# EAGLE design Micro__BLDC (EAGLE 6.5.0)
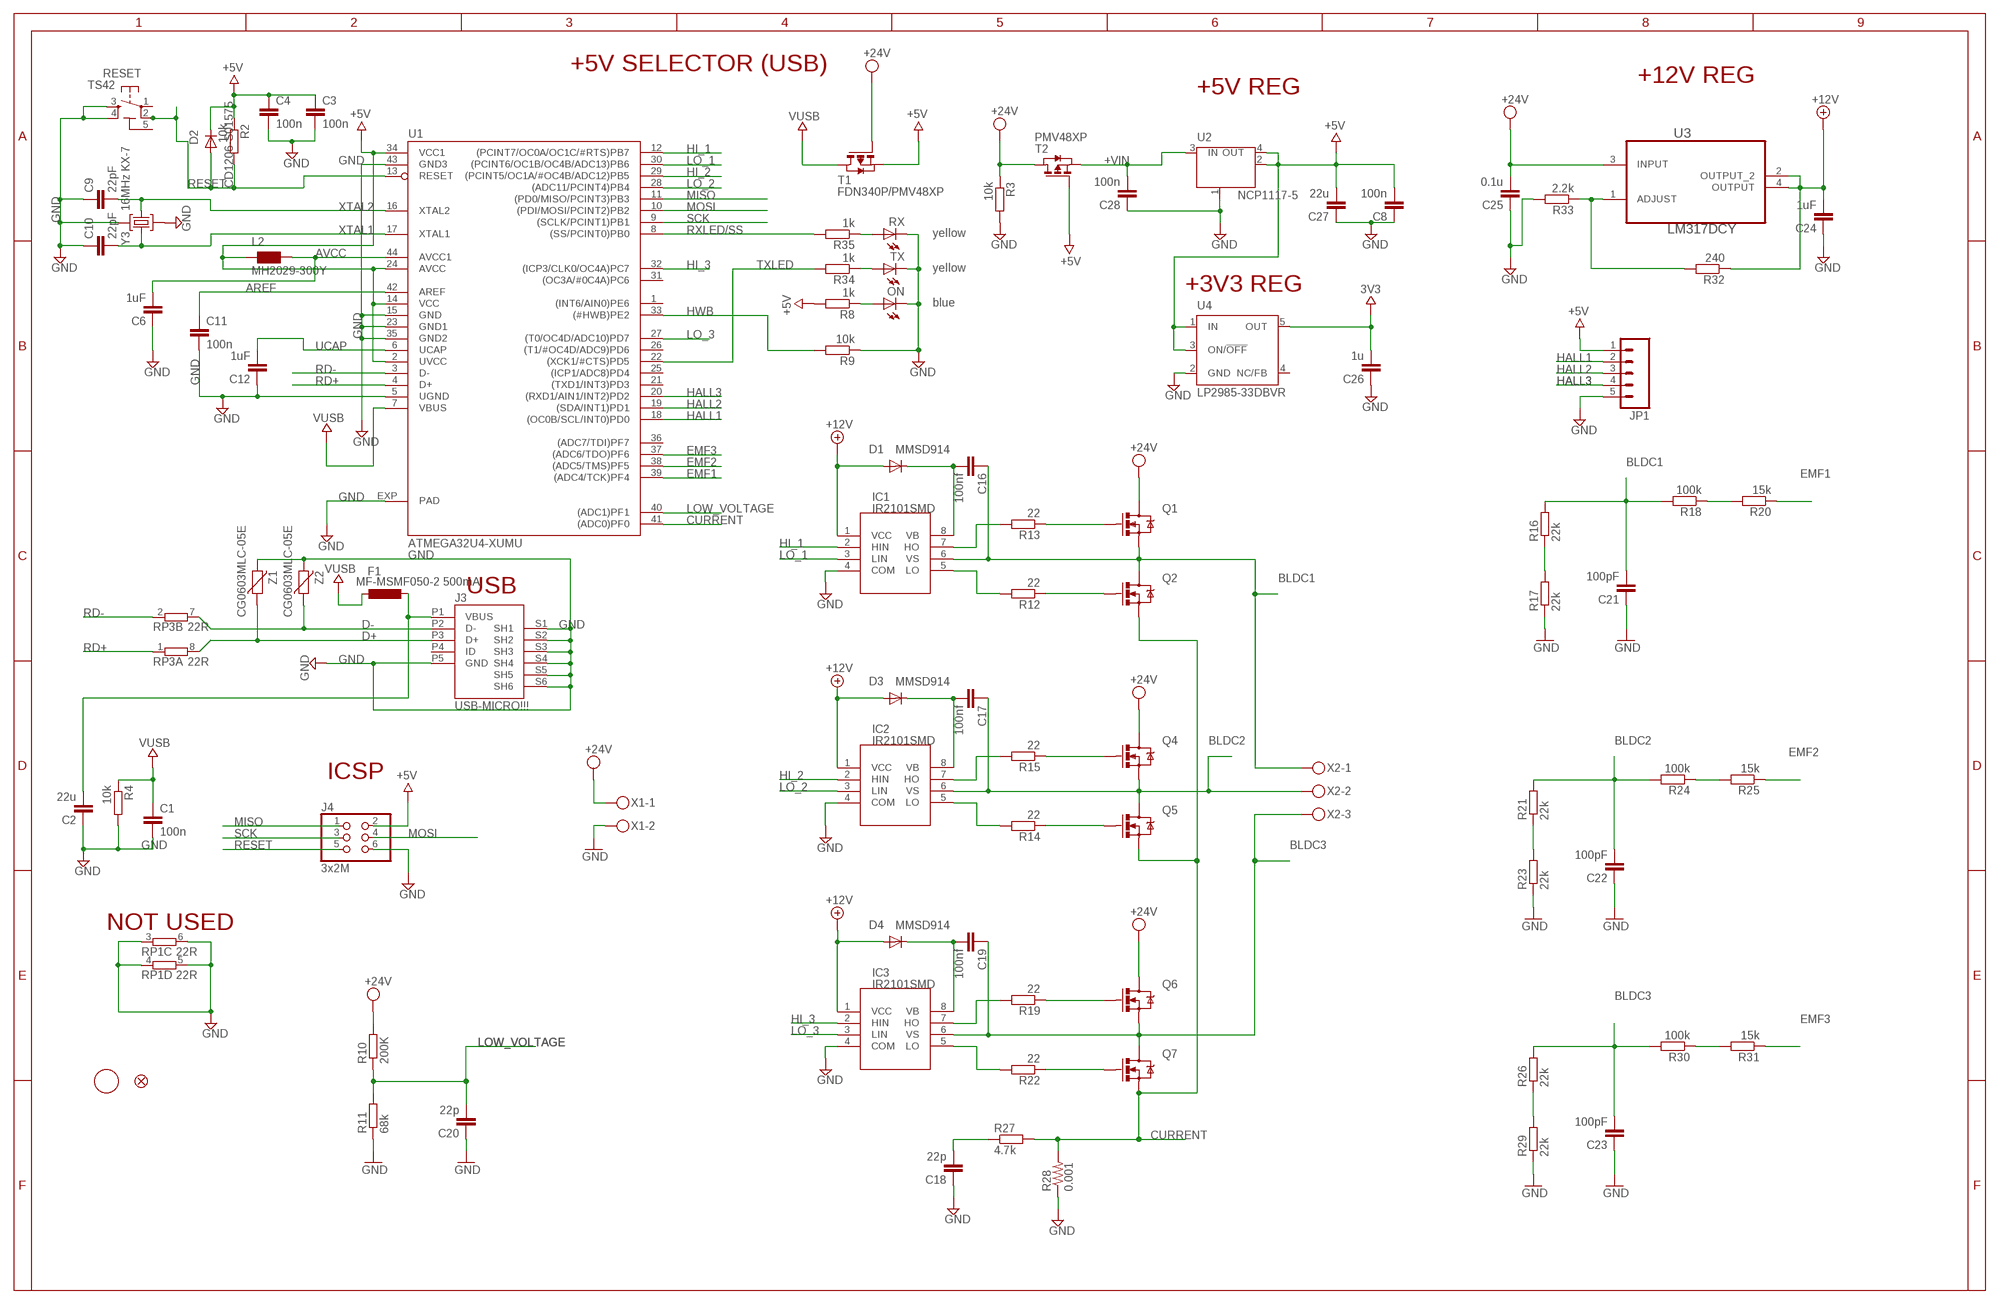
[diagram p0: schematic, sheet 1]

## Parts
C1  100n  C-EUC1206  [C1206]
C2  22u  C-EUC1206  [C1206]
C3  100n  C-EUC1206  [C1206]
C4  100n  C-EUC1206  [C1206]
C6  1uF  C-EUC1206  [C1206]
C8  100n  C-EUC1206  [C1206]
C9  22pF  C-EUC1206  [C1206]
C10  22pF  C-EUC1206  [C1206]
C11  100n  C-EUC1206  [C1206]
C12  1uF  C-EUC1206  [C1206]
C16  100nf  C-EUC1206  [C1206]
C17  100nf  C-EUC1206  [C1206]
C18  22p  C-EUC1206  [C1206]
C19  100nf  C-EUC1206  [C1206]
C20  22p  C-EUC1206  [C1206]
C21  100pF  C-EUC1206  [C1206]
C22  100pF  C-EUC1206  [C1206]
C23  100pF  C-EUC1206  [C1206]
C24  1uF  C-EUC1206  [C1206]
C25  0.1u  C-EUC1206  [C1206]
C26  1u  C-EUC1206  [C1206]
C27  22u  C-EUC1206  [C1206]
C28  100n  C-EUC1206  [C1206]
D1  MMSD914  DIODE-SOD123  [SOD123]
D2  CD1206-S01575  DIODE-MINIMELF  [MINIMELF]
D3  MMSD914  DIODE-SOD123  [SOD123]
D4  MMSD914  DIODE-SOD123  [SOD123]
F1  MF-MSMF050-2 500mA  L-EUL1812  [L1812]
IC1  IR2101SMD  [SO08]
IC2  IR2101SMD  [SO08]
IC3  IR2101SMD  [SO08]
J3  USB-MICRO!!!  MYCON2_USB-MINI-B  [CON2_USB_MICRO_B_AT]
J4  3x2M  PINHD-2X3  [2X03]
JP1  M05PTH  [1X05]
L2  MH2029-300Y  WE-CBF_0805  [0805]
ON  blue  LEDCHIPLED_0805  [CHIPLED_0805]
Q1  MOSFET-NCHANNELPTH2  [TO220V]
Q2  MOSFET-NCHANNELPTH2  [TO220V]
Q4  MOSFET-NCHANNELPTH2  [TO220V]
Q5  MOSFET-NCHANNELPTH2  [TO220V]
Q6  MOSFET-NCHANNELPTH2  [TO220V]
Q7  MOSFET-NCHANNELPTH2  [TO220V]
R2  10k  R-EU_R1206  [R1206]
R3  10k  R-EU_R1206  [R1206]
R4  10k  R-EU_R1206  [R1206]
R8  1k  R-EU_R1206  [R1206]
R9  10k  R-EU_R1206  [R1206]
R10  200K  R-EU_R1206  [R1206]
R11  68k  R-EU_R1206  [R1206]
R12  22  R-EU_R1206  [R1206]
R13  22  R-EU_R1206  [R1206]
R14  22  R-EU_R1206  [R1206]
R15  22  R-EU_R1206  [R1206]
R16  22k  R-EU_R1206  [R1206]
R17  22k  R-EU_R1206  [R1206]
R18  100k  R-EU_R1206  [R1206]
R19  22  R-EU_R1206  [R1206]
R20  15k  R-EU_R1206  [R1206]
R21  22k  R-EU_R1206  [R1206]
R22  22  R-EU_R1206  [R1206]
R23  22k  R-EU_R1206  [R1206]
R24  100k  R-EU_R1206  [R1206]
R25  15k  R-EU_R1206  [R1206]
R26  22k  R-EU_R1206  [R1206]
R27  4.7k  R-EU_R1206  [R1206]
R28  0.001  R-US_R2512  [R2512]
R29  22k  R-EU_R1206  [R1206]
R30  100k  R-EU_R1206  [R1206]
R31  15k  R-EU_R1206  [R1206]
R32  240  R-EU_R1206  [R1206]
R33  2.2k  R-EU_R1206  [R1206]
R34  1k  R-EU_R1206  [R1206]
R35  1k  R-EU_R1206  [R1206]
RESET  TS42  [TS42]
RP1  22R  4R-NCAY16  [CAY16]
RP3  22R  4R-NCAY16  [CAY16]
RX  yellow  LEDCHIPLED_0805  [CHIPLED_0805]
T1  FDN340P/PMV48XP  PMOSSOT23  [SOT-23]
T2  PMV48XP  PMOSSOT23  [SOT-23]
TX  yellow  LEDCHIPLED_0805  [CHIPLED_0805]
U1  ATMEGA32U4-XUMU  [QFN44ML7X7]
U2  NCP1117-5  LINEAR_MC33269ST  [LINEAR_SOT223]
U3  LM317DCY  [SOT230P700X180-4N]
U4  LP2985-33DBVR  LP2985-XXDBVR33  [SOT23-DBV]
U$37  FIDUCIALMOUNT  [FIDUCIA-MOUNT]
U$53  FIDUCIAL1X2  [FIDUCIAL-1X2]
X1  MKDSN1,5/2-5,08  [MKDSN1,5/2-5,08]
X2  MKDSN1,5/3-5,08  [MKDSN1,5/3-5,08]
Y3  16MHz KX-7  CRYSTAL-3.2-2.5  [CRYSTAL-3.2-2.5]
Z1  CG0603MLC-05E  VARISTORCN0603  [CT/CN0603]
Z2  CG0603MLC-05E  VARISTORCN0603  [CT/CN0603]

## Nets
3V3: C26.2 U4.5(OUT)
+5V: C3.1 C4.1 C8.2 C27.2 D2.C J4.2 JP1.1 L2.1 R2.1 R8.2 T1.2(S) T2.3(G) U1.2(UVCC) U1.14(VCC) U1.24(AVCC) U1.34(VCC1) U2.2(OUT) U2.4(OUT) U4.1(IN) U4.3(ON/!OFF)
+12V: C24.2 D1.A D3.A D4.A IC1.1(VCC) IC2.1(VCC) IC3.1(VCC) R32.1 U3.2(OUTPUT_2) U3.4(OUTPUT)
+VIN: C28.2 T2.2(S) U2.3(IN)
AREF: C11.1 U1.42(AREF)
AVCC: C6.2 L2.2 U1.44(AVCC1)
BLDC1: C16.1 C21.2 IC1.6(VS) Q1.3(S) Q2.2(D) R16.2 R18.2 X2.1
BLDC2: C17.1 C22.2 IC2.6(VS) Q4.3(S) Q5.2(D) R21.2 R24.2 X2.2
BLDC3: C19.1 C23.2 IC3.6(VS) Q6.3(S) Q7.2(D) R26.2 R30.2 X2.3
CURRENT: Q2.3(S) Q5.3(S) Q7.3(S) R27.2 R28.2 U1.41((ADC0)PF0)
D+: J3.P3(D+) RP3.8 Z1.1
D-: J3.P2(D-) RP3.7 Z2.1
EMF1: R20.1 U1.39((ADC4/TCK)PF4)
EMF2: R25.1 U1.38((ADC5/TMS)PF5)
EMF3: R31.1 U1.37((ADC6/TDO)PF6)
GND: C1.2 C2.1 C3.2 C4.2 C6.1 C8.1 C9.1 C10.1 C11.2 C12.1 C18.1 C20.1 C21.1 C22.1 C23.1 C24.1 C25.1 C26.1 C27.1 C28.1 IC1.4(COM) IC2.4(COM) IC3.4(COM) J3.P5(GND) J3.S1(SH1) J3.S2(SH2) J3.S3(SH3) J3.S4(SH4) J3.S5(SH5) J3.S6(SH6) J4.6 JP1.5 ON.C R3.2 R4.2 R9.1 R11.1 R17.1 R23.1 R28.1 R29.1 R33.2 RESET.3 RESET.4 RP1.3 RP1.4 RP1.5 RP1.6 RX.C TX.C U1.5(UGND) U1.15(GND) U1.23(GND1) U1.35(GND2) U1.43(GND3) U1.EXP(PAD) U2.1(GND/ADJ) U4.2(GND) X1.2 Y3.2(GND) Y3.4(GND) Z1.2 Z2.2
HALL1: JP1.2 U1.18((OC0B/SCL/INT0)PD0)
HALL2: JP1.3 U1.19((SDA/INT1)PD1)
HALL3: JP1.4 U1.20((RXD1/AIN1/INT2)PD2)
HI_1: IC1.2(HIN) U1.12((PCINT7/OC0A/OC1C/#RTS)PB7)
HI_2: IC2.2(HIN) U1.29((PCINT5/OC1A/#OC4B/ADC12)PB5)
HI_3: IC3.2(HIN) U1.32((ICP3/CLK0/OC4A)PC7)
HWB: R9.2 U1.33((#HWB)PE2)
LO_1: IC1.3(LIN) U1.30((PCINT6/OC1B/OC4B/ADC13)PB6)
LO_2: IC2.3(LIN) U1.28((ADC11/PCINT4)PB4)
LO_3: IC3.3(LIN) U1.27((T0/OC4D/ADC10)PD7)
LOW_VOLTAGE: C20.2 R10.1 R11.2 U1.40((ADC1)PF1)
MISO: J4.1 U1.11((PD0/MISO/PCINT3)PB3)
MOSI: J4.4 U1.10((PDI/MOSI/PCINT2)PB2)
N$1: Q4.1(G) R15.1
N$2: R35.1 RX.A
N$3: ON.A R8.1
N$4: R34.1 TX.A
N$5: R32.2 R33.1 U3.1(ADJUST)
N$9: C18.2 R27.1
N$11: R16.1 R17.2
N$12: R18.1 R20.2
N$13: IC3.7(HO) R19.2
N$14: Q6.1(G) R19.1
N$15: Q7.1(G) R22.1
N$16: IC3.5(LO) R22.2
N$17 [usbvcc]: C19.2 D4.C IC3.8(VB)
N$18: R21.1 R23.2
N$19: R24.1 R25.2
N$21: IC2.7(HO) R15.2
N$23 [gnd]: Q5.1(G) R14.1
N$24: IC2.5(LO) R14.2
N$25 [usbvcc]: C17.2 D3.C IC2.8(VB)
N$26: R26.1 R29.2
N$28: R30.1 R31.2
N$29: IC1.7(HO) R13.2
N$30: Q1.1(G) R13.1
N$31: Q2.1(G) R12.1
N$32: IC1.5(LO) R12.2
N$33 [usbvcc]: C16.2 D1.C IC1.8(VB)
RD+: RP3.1 U1.4(D+)
RD-: RP3.2 U1.3(D-)
RESET: D2.A J4.5 R2.2 RESET.2 U1.13(RESET)
RXLED/SS: R35.2 U1.8((SS/PCINT0)PB0)
SCK: J4.3 U1.9((SCLK/PCINT1)PB1)
TXLED: R34.2 U1.22((XCK1/#CTS)PD5)
UCAP: C12.2 U1.6(UCAP)
VCC: C25.2 Q1.2(D) Q4.2(D) Q6.2(D) R3.1 R10.2 T1.3(G) T2.1(D) U3.3(INPUT) X1.1 ; supply symbol labelled +24V
VUSB: C1.1 F1.2 R4.1 T1.1(D) U1.7(VBUS)
VUSBD: C2.2 F1.1 J3.P1(VBUS)
XTAL1: C10.2 U1.17(XTAL1) Y3.3(C2)
XTAL2: C9.2 U1.16(XTAL2) Y3.1(C1)
Unconnected: J3.P4(ID) RESET.1 RP1.1 RP1.2 RP1.7 RP1.8 RP3.3 RP3.4 RP3.5 RP3.6 U1.1((INT6/AIN0)PE6) U1.21((TXD1/INT3)PD3) U1.25((ICP1/ADC8)PD4) U1.26((T1/#OC4D/ADC9)PD6) U1.31((OC3A/#0C4A)PC6) U1.36((ADC7/TDI)PF7) U4.4(NC/FB)

## Notes on the sheet
- +5V SELECTOR (USB)
- +12V REG
- +5V REG
- +3V3 REG
- USB
- ICSP
- NOT USED

## Power pins joined to a net without a drawn wire
5-GND: RESET.5(5-GND)

## Library data of the parts
C1-C4 C6 C8-C12 C16-C28 = SmartPrj:C-EU: CAPACITOR, European symbol
D1-D4 = diode:DIODE-: DIODE
F1 = rcl:L-EU: INDUCTOR, European symbol
IC1-IC3 = IR:IR2101
J3 = SmartPrj:MYCON2_USB-MINI-B
J4 = SmartPrj:PINHD-2X3: PIN HEADER
JP1 = SparkFun-Connectors:M05: Header 5 Standard 5-pin 0.1" header. Use with straight break away headers (SKU : PRT-00116), right angle break away headers (PRT-00553), swiss pins (PRT-00743), machine pins (PRT-00117), and female headers (PRT-00115). Molex polarized connector foot print use with SKU : PRT-08230 with associated crimp pins and housings.
L2 = wuerth-elektronik:WE-CBF: SMD EMI Suppression Ferrite Beads - excellent anti-EMI properties - low DCR - impedances till 3000 ohms - rated current up to 6 A
ON RX TX = led:LED: LED OSRAM: - CHIPLED LG R971, LG N971, LY N971, LG Q971, LY Q971, LO R971, LY R971 LH N974, LH R974 LS Q976, LO Q976, LY Q976 LO Q996 - Hyper CHIPLED LW Q18S LB Q993, LB Q99A, LB R99A - SideLED LS A670, LO A670, LY A670, LG A670, LP A670 LB A673, LV A673, LT A673, LW A673 LH A674 LY A675 LS A676, LA A676, LO A676, LY A676, LW A676 LS A679, LY A679, LG A679 - Hyper Micro SIDELED® LS Y876, LA Y876, LO Y876, LY Y876 LT Y87S - SmartLED LW L88C, LW L88S LB L89C, LB L89S, LG L890 LS L89K, LO L89K, LY L89K LS L896, LA L896, LO L896, LY L896 - TOPLED LS T670, LO T670, LY T670, LG T670, LP T670 LSG T670, LSP T670, LSY T670, LOP T670, LYG T670 LG T671, LOG T671, LSG T671 LB T673, LV T673, LT T673, LW T673 LH T674 LS T676, LA T676, LO T676, LY T676, LB T676, LH T676, LSB T676, LW T676 LB T67C, LV T67C, LT T67C, LS T67K, LO T67K, LY T67K, LW E67C LS E67B, LA E67B, LO E67B, LY E67B, LB E67C, LV E67C, LT E67C LW T67C LS T679, LY T679, LG T679 LS T770, LO T770, LY T770, LG T770, LP T770 LB T773, LV T773, LT T773, LW T773 LH T774 LS E675, LA E675, LY E675, LS T675 LS T776, LA T776, LO T776, LY T776, LB T776 LHGB T686 LT T68C, LB T68C - Hyper Mini TOPLED® LB M676 - Mini TOPLED Santana® LG M470 LS M47K, LO M47K, LY M47K Source: http://www.osram.convergy.de LUXEON: - LUMILED® LXK2-PW12-R00, LXK2-PW12-S00, LXK2-PW14-U00, LXK2-PW14-V00 LXK2-PM12-R00, LXK2-PM12-S00, LXK2-PM14-U00 LXK2-PE12-Q00, LXK2-PE12-R00, LXK2-PE12-S00, LXK2-PE14-T00, LXK2-PE14-U00 LXK2-PB12-K00, LXK2-PB12-L00, LXK2-PB12-M00, LXK2-PB14-N00, LXK2-PB14-P00, LXK2-PB14-Q00 LXK2-PR12-L00, LXK2-PR12-M00, LXK2-PR14-Q00, LXK2-PR14-R00 LXK2-PD12-Q00, LXK2-PD12-R00, LXK2-PD12-S00 LXK2-PH12-R00, LXK2-PH12-S00 LXK2-PL12-P00, LXK2-PL12-Q00, LXK2-PL12-R00 Source: www.luxeon.com KINGBRIGHT: KA-3528ASYC Source: www.kingbright.com
Q1 Q2 Q4-Q7 = SparkFun:MOSFET-NCHANNEL
R2-R4 R8-R27 R29-R35 = SmartPrj:R-EU_: RESISTOR, European symbol
R28 = resistor:R-US_: RESISTOR, American symbol
RESET = SmartPrj:TS42: TS42 Dongnan Electronics Tact switch VDC 12V - 50mA
RP1 RP3 = resistor-dil:4R-N: Array Chip Resistor Source: RS Component / Phycomp
T1 T2 = zetex:PMOSSOT23: MOS FET
U1 = SmartPrj:ATMEGA32U4-XU
U2 = SmartPrj:LINEAR_MC33269ST*: Adjustable Output Low Dropout Voltage Regulator 800 mA Source: http://www.onsemi.com/pub/Collateral/MC33269-D.PDF
U3 = Texas Instruments_By_element14_Batch_1:LM317DCY: IC ADJ LINEAR REG 1.25V TO 37V; MPN: LM317DCY; OC_FARNELL: 1626539; OC_NEWARK: 75C0809; PACKAGE: SOT-223-3; SUPPLIER: TEXAS INSTRUMENTS
U4 = SmartPrj:LP2985-XXDBVR: ULTRALOW-POWER 50-mA LOW-DROPOUT LINEAR REGULATORS 50-mA Low-Dropout Regulator Source: http://focus.ti.com/lit/ds/symlink/tps77001.pdf
U$37 = SmartPrj:FIDUCIALMOUNT
U$53 = SparkFun:FIDUCIAL: Fiducial Alignment Points Various fiducial points for machine vision alignment.
X1 = con-phoenix-508:MKDSN1,5/2-5,08: MKDSN 1,5/ 2-5,08 Printklemme Nennstrom: 13,5 A Nennspannung: 250 V Rastermaß: 5,08 mm Polzahl: 2 Anschlussart: Schraubanschluss Montage: Löten Anschlussrichtung Leiter/Platine: 0 ° Artikelnummer: 1729128 Source: http://eshop.phoenixcontact.com .. 1729128.pdf; MPN: MKDSN 1,5/2-5.08; OC_FARNELL: 1792903; OC_NEWARK: 30M2397
X2 = con-phoenix-508:MKDSN1,5/3-5,08: MKDSN 1,5/ 3-5,08 Printklemme Nennstrom: 13,5 A Nennspannung: 250 V Rastermaß: 5,08 mm Polzahl: 3 Anschlussart: Schraubanschluss Montage: Löten Anschlussrichtung Leiter/Platine: 0 ° Artikelnummer: 1729131 Source: http://eshop.phoenixcontact.com .. 1729131.pdf; MPN: SMKDSN1,5/3-5,08; OC_FARNELL: 1792904; OC_NEWARK: 70R0299
Y3 = SmartPrj:CRYSTAL-3.2-2.5
Z1 Z2 = varistor:VARISTOR: VARISTOR

## Net classes
0 default: width 0.254 mm, drill 0.61 mm, clearance 0.203 mm
2 gnd: width 0.254 mm, drill 0.61 mm, clearance 0.254 mm
3 usbvcc: width 0.254 mm, drill 0.61 mm, clearance 0.254 mm

## Board
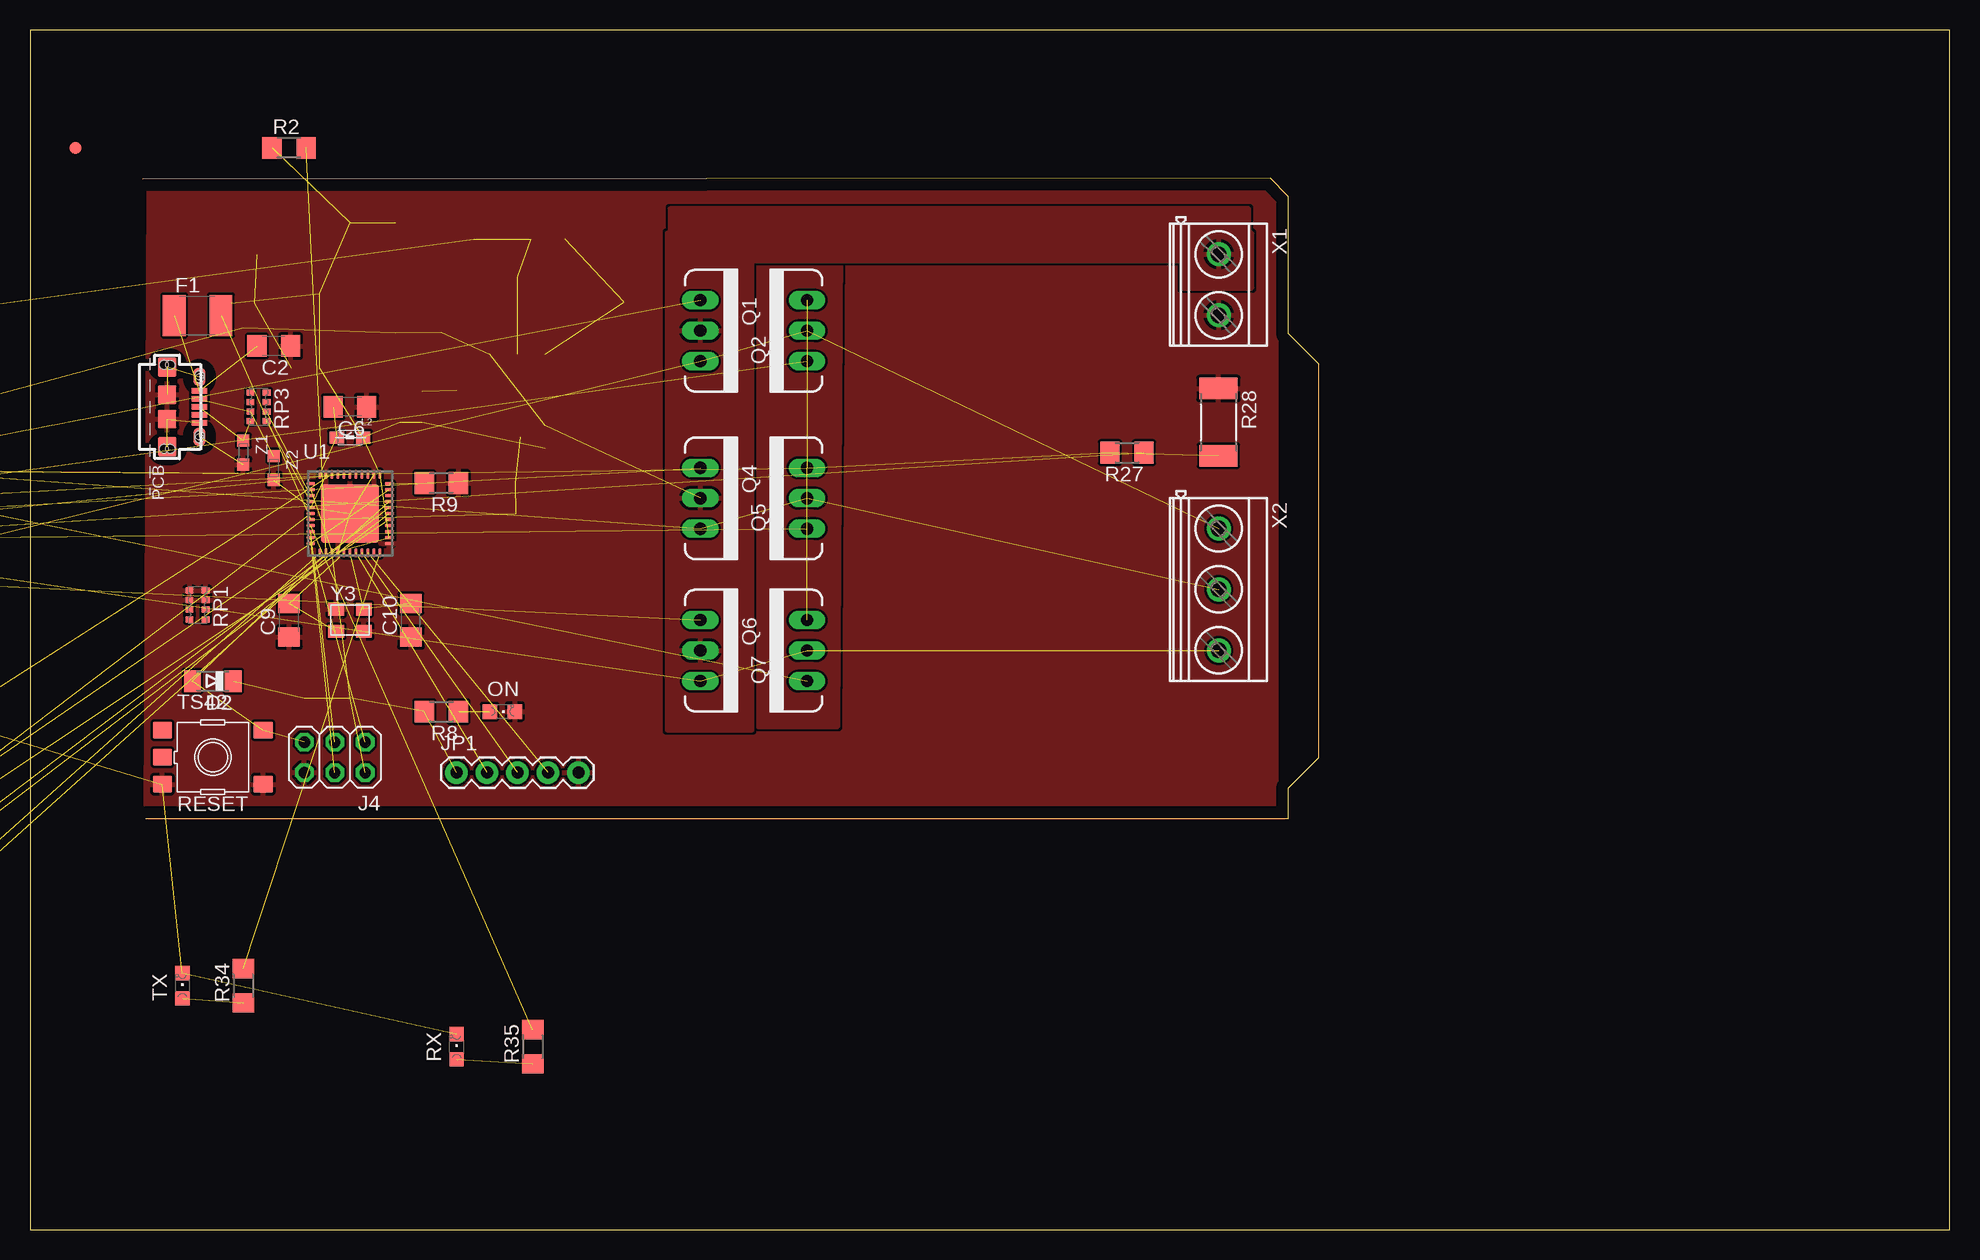
[diagram p1: board, top side]
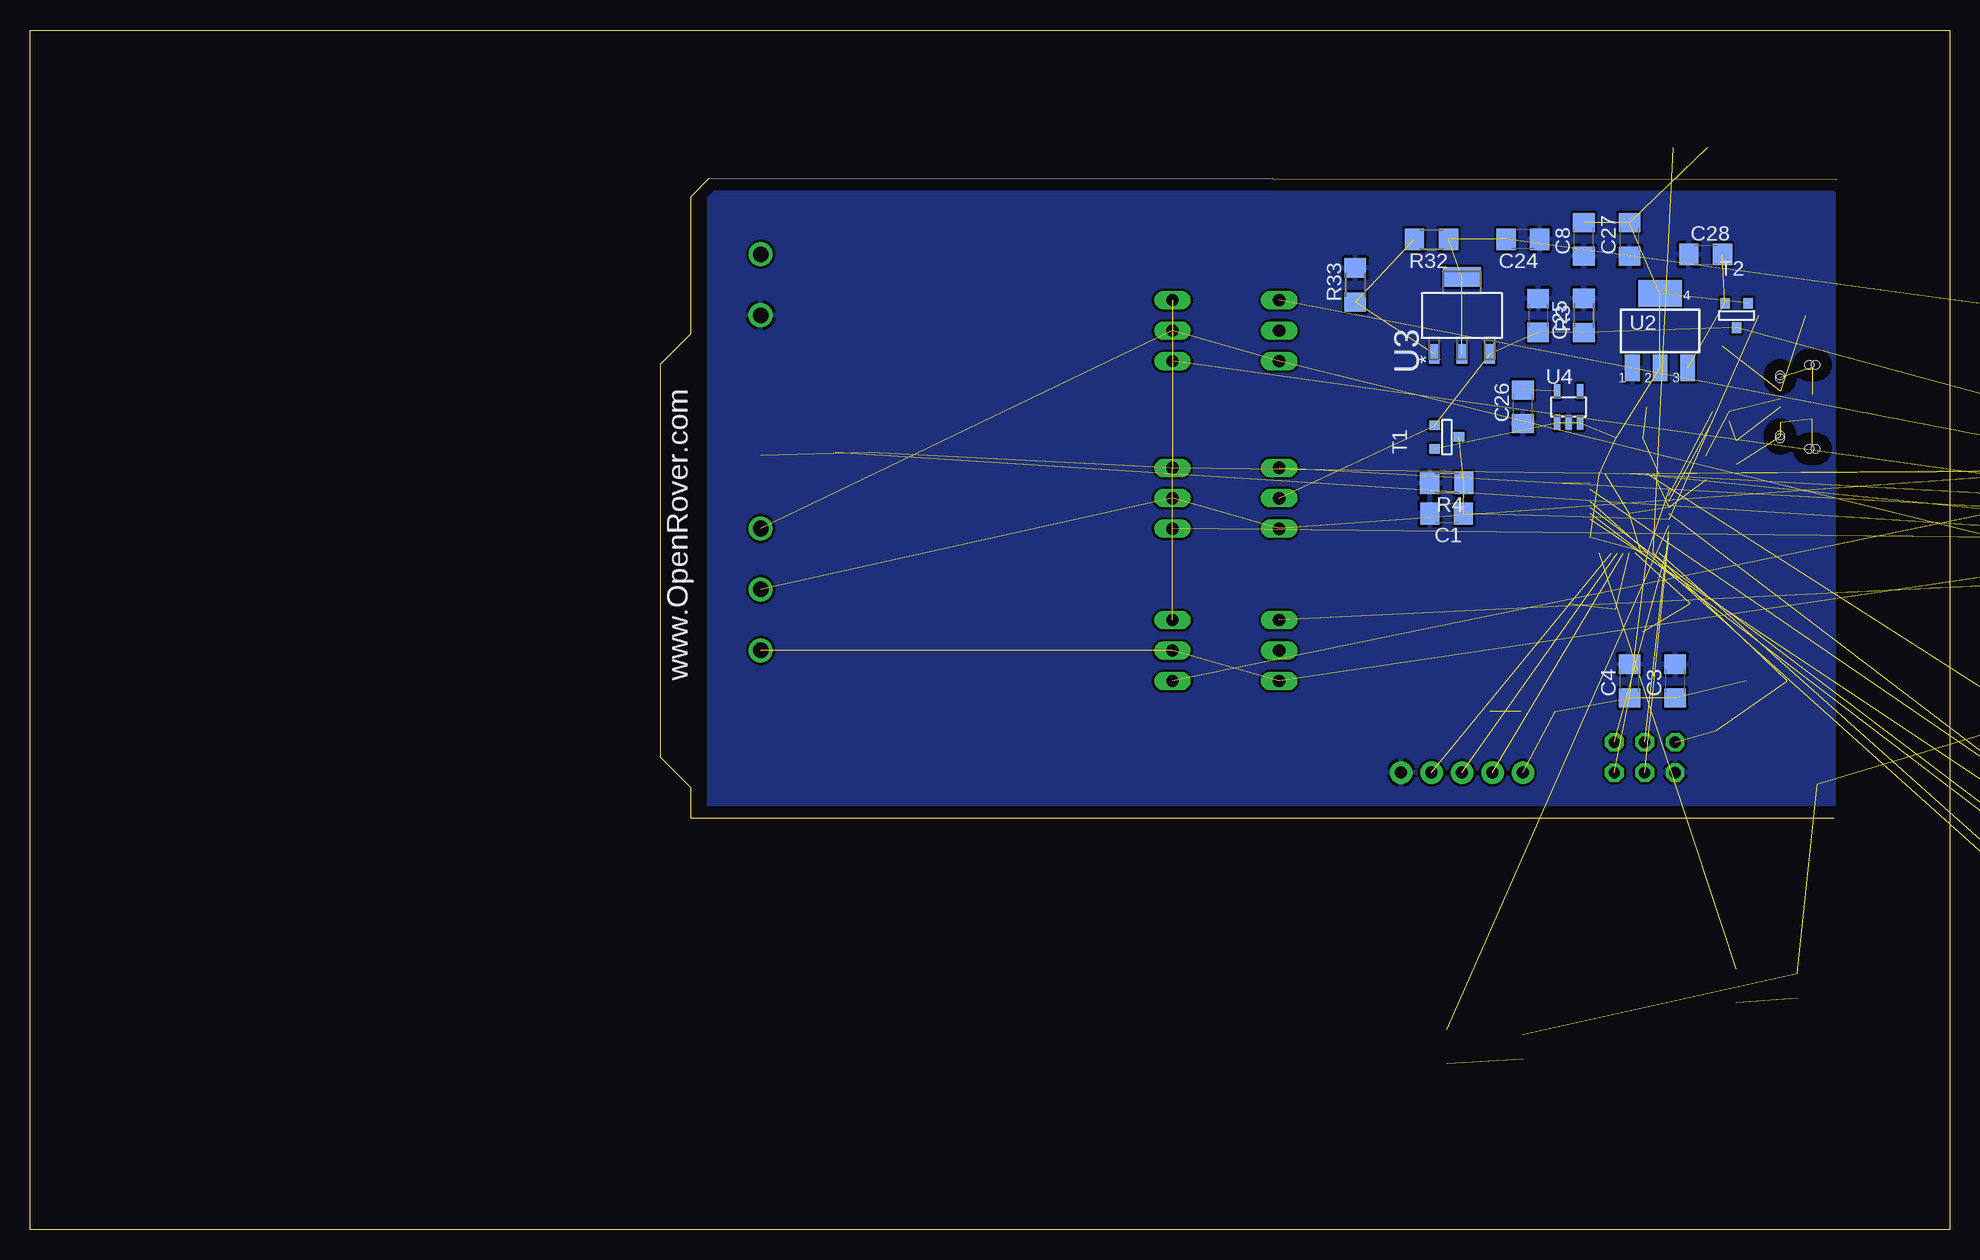
[diagram p2: board, bottom side, seen from below]

Size 160 x 100 mm. Coordinates in mm from the lower left corner, seen from the top.
Outline: 9.65,34.29 104.9,34.29 104.9,36.83 107.44,39.37 107.44,72.14 104.9,74.68 104.9,86.11 103.38,87.63 9.38,87.55
Outline: 0,0 160,0 160,100 0,100 0,0
Copper layers (1*16): Top 0.035mm / dielectric 1.5mm / Bottom 0.035mm
Design rules "default": minimum track width 10mil, minimum drill 24mil, track to track 8mil, track to pad 8mil, pad to pad 8mil, via to via 8mil, smd to smd 8mil, copper to edge 40mil, drill to drill 8mil, minimum pad ring 10mil, minimum via ring 8mil, stop-mask expansion 4mil, vias tented up to drill 0mil, thermal gap 10mil

### Footprints (pad centres in the part's own frame; a part is rotated, then mirrored left to right if it is on the bottom)
C1206 = smd 1.6 x 1.8: 1 -1.4,0; 2 1.4,0
SOD123 = smd 1.4 x 1.4: A 1.9,0; C -1.9,0
MINIMELF = smd 1.4 x 1.8: A 1.7,0; C -1.7,0
L1812 = smd 1.9 x 3.4: 1 -1.95,0; 2 1.95,0
SO08 = smd 0.6 x 2.2: 1 -1.905,-2.6; 2 -0.635,-2.6; 3 0.635,-2.6; 4 1.905,-2.6; 5 1.905,2.6; 6 0.635,2.6; 7 -0.635,2.6; 8 -1.905,2.6
CON2_USB_MICRO_B_AT = smd 0.406 x 1.346: P1 -1.321,2.692; P2 -0.66,2.692; P3 0,2.692; P4 0.66,2.692; P5 1.321,2.692 | smd 1.651 x 1.549: S1 -3.302,0; S2 3.302,0 | smd 1.524 x 1.016: S3 -2.489,2.692; S4 2.489,2.692 | smd 1.524 x 1.524: S5 -1.016,0; S6 1.016,0 | hole 0.7: -3.505,0.254; -3.505,-0.254; 3.505,0.254; 3.505,-0.254; -2.616,2.692; -2.362,2.692; 2.362,2.692; 2.616,2.692
2X03 = drill 0.95 pad 1.55 octagon: 1 -2.54,-1.27; 2 -2.54,1.27; 3 0,-1.27; 4 0,1.27; 5 2.54,-1.27; 6 2.54,1.27
1X05 = drill 1.016 pad 1.88: 1 0,0; 2 2.54,0; 3 5.08,0; 4 7.62,0; 5 10.16,0
0805 = smd 1.2 x 1: 1 -1.1,0; 2 1.1,0
CHIPLED_0805 = smd 1.2 x 1.2: A 0,-1.05; C 0,1.05
TO220V = drill 1.016 long: 1 -2.54,0; 2 0,0; 3 2.54,0
R1206 = smd 1.6 x 1.803: 1 -1.422,0; 2 1.422,0
R2512 = smd 1.8 x 3.2: 1 -2.8,0; 2 2.8,0
TS42 = smd 1.6 x 1.4: 1 -4.2,2.25; 2 4.2,2.25; 3 -4.2,-2.25; 4 4.2,-2.25; 5 -4.2,0
CAY16 = smd 0.5 x 0.65: 1 -1.2,-0.675; 2 -0.4,-0.675; 3 0.4,-0.675; 4 1.2,-0.675; 5 1.2,0.675; 6 0.4,0.675; 7 -0.4,0.675; 8 -1.2,0.675
SOT-23 = smd 0.787 x 0.889: 1 0.025,-1.016; 2 -0.94,1.016; 3 0.991,1.016
QFN44ML7X7 = smd 0.75 x 0.275: 1 -3.275,2.5; 2 -3.275,2; 3 -3.275,1.5; 4 -3.275,1; 5 -3.275,0.5; 6 -3.275,0; 7 -3.275,-0.5; 8 -3.275,-1; 9 -3.275,-1.5; 10 -3.275,-2; 11 -3.275,-2.5; 23 3.275,-2.5; 24 3.275,-2; 25 3.275,-1.5; 26 3.275,-1; 27 3.275,-0.5; 28 3.275,0; 29 3.275,0.5; 30 3.275,1; 31 3.275,1.5; 32 3.275,2; 33 3.275,2.5 | smd 0.275 x 0.75: 12 -2.5,-3.275; 13 -2,-3.275; 14 -1.5,-3.275; 15 -1,-3.275; 16 -0.5,-3.275; 17 0,-3.275; 18 0.5,-3.275; 19 1,-3.275; 20 1.5,-3.275; 21 2,-3.275; 22 2.5,-3.275; 34 2.5,3.275; 35 2,3.275; 36 1.5,3.275; 37 1,3.275; 38 0.5,3.275; 39 0,3.275; 40 -0.5,3.275; 41 -1,3.275; 42 -1.5,3.275; 43 -2,3.275; 44 -2.5,3.275 | smd 4.826 x 4.826: EXP 0,0
LINEAR_SOT223 = smd 1.219 x 2.235: 1 -2.311,-3.099; 2 0,-3.099; 3 2.311,-3.099 | smd 3.6 x 2.2: 4 0,3.099
SOT230P700X180-4N = smd 1.626 x 0.889: 1 -3.2,2.311; 2 -3.2,0; 3 -3.2,-2.311 | smd 1.626 x 3.175: 4 3.2,0
SOT23-DBV = smd 0.55 x 1.2: 1 -0.95,-1.3; 2 0,-1.3; 3 0.95,-1.3; 4 0.95,1.3; 5 -0.95,1.3
FIDUCIA-MOUNT = smd 1.016 x 1.016: P$1 0,0
FIDUCIAL-1X2 = smd 1 x 1: 1 0,0
MKDSN1,5/2-5,08 = drill 1.3 pad 2: 1 -2.561,0.025; 2 2.519,0.025
MKDSN1,5/3-5,08 = drill 1.3 pad 2: 1 -7.641,0.025; 2 -2.561,0.025; 3 2.519,0.025
CRYSTAL-3.2-2.5 = smd 1.3 x 1.05: 1 -1.15,-0.925; 2 1.15,-0.925; 3 1.15,0.925; 4 -1.15,0.925
CT/CN0603 = smd 1 x 1: 1 -1,0; 2 1,0

### Placement (x,y rotation side)
C1  41.91,59.69 180 bottom
C2  20.32,73.66 180 top
C3  22.86,45.72 90 bottom
C4  26.67,45.72 90 bottom
C6  26.67,68.58 180 top
C8  30.48,82.55 90 bottom
C9  21.59,50.8 90 top
C10  31.75,50.8 90 top
C11  -6.35,41.91 0 top  (outside the outline)
C12  -6.35,38.1 0 top  (outside the outline)
C16  -54.61,50.8 0 top  (outside the outline)
C17  -60.96,50.8 0 top  (outside the outline)
C18  -27.94,57.15 0 top  (outside the outline)
C19  -67.31,50.8 0 top  (outside the outline)
C20  -33.02,57.15 0 top  (outside the outline)
C21  -33.02,50.8 0 top  (outside the outline)
C22  -40.64,50.8 0 top  (outside the outline)
C23  -48.26,50.8 0 top  (outside the outline)
C24  35.56,82.55 180 bottom
C25  34.29,76.2 270 bottom
C26  35.56,68.58 90 bottom
C27  26.67,82.55 90 bottom
C28  20.32,81.28 0 bottom
D1  -62.23,63.5 0 top  (outside the outline)
D2  15.24,45.72 180 top
D3  -73.66,63.5 0 top  (outside the outline)
D4  -58.42,69.85 0 top  (outside the outline)
F1  13.97,76.2 0 top
IC1  -35.56,5.08 0 top  (outside the outline)
IC2  -45.72,5.08 0 top  (outside the outline)
IC3  -55.88,5.08 0 top  (outside the outline)
J3  11.43,68.58 270 top
J4  25.4,39.37 180 top
JP1  35.56,38.1 0 top
L2  26.67,66.04 180 top
ON  39.37,43.18 270 top
Q1  55.88,74.93 270 top
Q2  64.77,74.93 90 top
Q4  55.88,60.96 270 top
Q5  64.77,60.96 90 top
Q6  55.88,48.26 270 top
Q7  64.77,48.26 90 top
R2  21.59,90.17 0 top
R3  30.48,76.2 90 bottom
R4  41.91,62.23 180 bottom
R8  34.29,43.18 180 top
R9  34.29,62.23 180 top
R10  -73.66,50.8 0 top  (outside the outline)
R11  -38.1,57.15 0 top  (outside the outline)
R12  -43.18,57.15 0 top  (outside the outline)
R13  -48.26,57.15 0 top  (outside the outline)
R14  -53.34,57.15 0 top  (outside the outline)
R15  -58.42,57.15 0 top  (outside the outline)
R16  -63.5,57.15 0 top  (outside the outline)
R17  -68.58,57.15 0 top  (outside the outline)
R18  -80.01,50.8 0 top  (outside the outline)
R19  -73.66,57.15 0 top  (outside the outline)
R20  -78.74,57.15 0 top  (outside the outline)
R21  -15.24,63.5 0 top  (outside the outline)
R22  -20.32,63.5 0 top  (outside the outline)
R23  -25.4,63.5 0 top  (outside the outline)
R24  -16.51,57.15 0 top  (outside the outline)
R25  -30.48,63.5 0 top  (outside the outline)
R26  -35.56,63.5 0 top  (outside the outline)
R27  91.44,64.77 180 top
R28  99.06,67.31 270 top
R29  -45.72,63.5 0 top  (outside the outline)
R30  -22.86,57.15 0 top  (outside the outline)
R31  -50.8,63.5 0 top  (outside the outline)
R32  43.18,82.55 180 bottom
R33  49.53,78.74 90 bottom
R34  17.78,20.32 90 top
R35  41.91,15.24 90 top
RESET  15.24,39.37 0 top
RP1  13.97,52.07 90 top
RP3  19.05,68.58 90 top
RX  35.56,15.24 0 top
T1  41.91,66.04 90 bottom
T2  17.78,76.2 0 bottom
TX  12.7,20.32 0 top
U1  26.67,59.69 0 top
U2  24.13,74.93 0 bottom
U3  40.64,76.2 90 bottom
U4  31.75,68.58 0 bottom
U$37  3.81,90.17 180 top
U$53  -48.26,83.82 0 top  (outside the outline)
X1  99.06,78.74 270 top
X2  99.06,50.8 270 top
Y3  26.67,50.8 0 top
Z1  17.78,64.77 270 top
Z2  20.32,63.5 270 top

### Tracks (layer width: path | path; a pad name or v marks a point on that pad's centre or on a via)
3V3  (1 unrouted)
+5V  (19 unrouted)
+12V  (9 unrouted)
+VIN  (2 unrouted)
AREF  (1 unrouted)
AVCC  (2 unrouted)
BLDC1  (7 unrouted)
BLDC2  (7 unrouted)
BLDC3  (7 unrouted)
CURRENT  (5 unrouted)
CURRENT1
  pour Top (rank 2): 60.71,41.91 60.71,82.04 67.56,82.3 67.31,41.91
D+  (2 unrouted)
D-  (2 unrouted)
EMF1  (1 unrouted)
EMF2  (1 unrouted)
EMF3  (1 unrouted)
GND  (27 unrouted)
  pour Bottom: 9.65,87.63 103.38,87.63 103.38,34.29 9.65,34.29
  pour Top (rank 3): 9.91,87.38 9.65,34.29 103.63,34.29 103.89,34.04 103.89,86.36 102.62,87.63 20.57,87.63
HALL1  (1 unrouted)
HALL2  (1 unrouted)
HALL3  (1 unrouted)
HI_1  (1 unrouted)
HI_2  (1 unrouted)
HI_3  (1 unrouted)
HWB  (1 unrouted)
LO_1  (1 unrouted)
LO_2  (1 unrouted)
LO_3  (1 unrouted)
LOW_VOLTAGE  (3 unrouted)
MISO  (1 unrouted)
MOSI  (1 unrouted)
N$1  (1 unrouted)
N$2  (1 unrouted)
N$3  (1 unrouted)
N$4  (1 unrouted)
N$5  (2 unrouted)
N$9  (1 unrouted)
N$11  (1 unrouted)
N$12  (1 unrouted)
N$13  (1 unrouted)
N$14  (1 unrouted)
N$15  (1 unrouted)
N$16  (1 unrouted)
N$17  (2 unrouted)
N$18  (1 unrouted)
N$19  (1 unrouted)
N$21  (1 unrouted)
N$23  (1 unrouted)
N$24  (1 unrouted)
N$25  (2 unrouted)
N$26  (1 unrouted)
N$28  (1 unrouted)
N$29  (1 unrouted)
N$30  (1 unrouted)
N$31  (1 unrouted)
N$32  (1 unrouted)
N$33  (2 unrouted)
RD+  (1 unrouted)
RD-  (1 unrouted)
RESET  (4 unrouted)
RXLED/SS  (1 unrouted)
SCK  (1 unrouted)
TXLED  (1 unrouted)
UCAP  (1 unrouted)
VCC  (6 unrouted)
  pour Top: 101.85,83.06 101.6,83.06 101.6,85.09 53.34,85.09 53.34,83.06 53.09,83.06 53.09,41.66 60.2,41.66 60.2,80.77 96.01,80.77 96.01,78.49 101.85,78.49
VUSB  (4 unrouted)
VUSBD  (2 unrouted)
XTAL1  (2 unrouted)
XTAL2  (2 unrouted)

### Text on the board
bPlace: www.OpenRover.com